# Altium schematic sheet CRSC0005.SchDoc: Critical System Computer - Power
size A3; Engineer: Sam Shan Jiang; DocumentNumber: CRSC0005; SheetNumber: 5; SheetTotal: 5; Description: Voltage regulator and power source select switch; Version: 1.0; DocumentName: Power
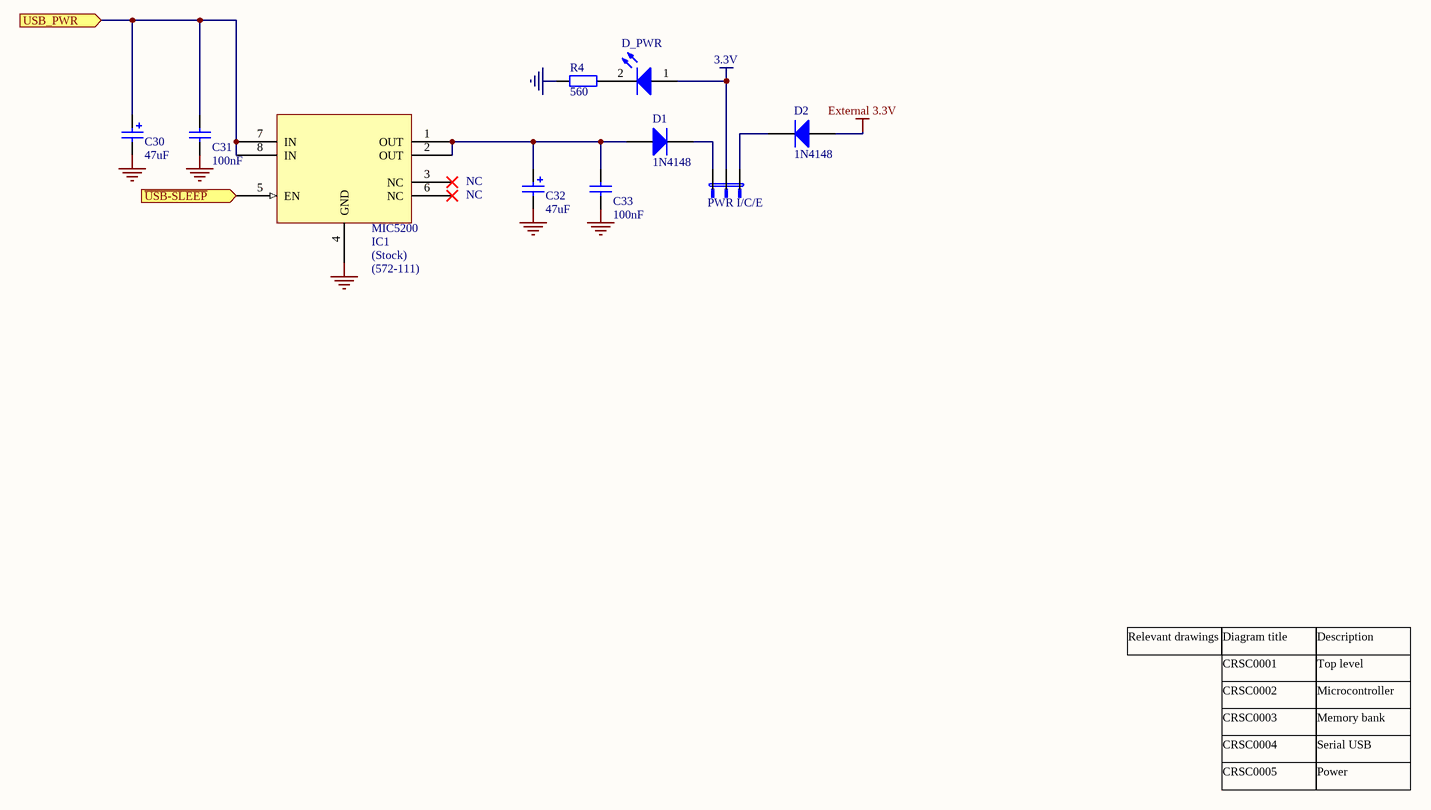
[diagram p0: CRSC0005.SchDoc]

## Parts
C30  value 47uF  [SMDD_E]  (hidden comment: Cap Pol3)
C31  value 100nF  [0805]  (hidden comment: Cap Semi)
C32  value 47uF  [smdd_e]  (hidden comment: Cap Pol3)
C33  value 100nF  [0805]  (hidden comment: Cap Semi)
D1  1N4148  [SOD123]
D2  1N4148  [SOD123]
D_PWR  LED  [0805]  (value not drawn)
IC1  MIC5200  [MIC5200-3.3BM]
PWR_I/C/E  3pins jumper  [JUMPER3pins]  (value not drawn)
R4  560  [0805]

## Ports
USB_PWR (in), ~{USB-SLEEP} (in)

## Nets
3.3V: D_PWR.1(A) PWR_I/C/E.2
External 3.3V: D2.1(A)
GND: C30.2 C31.2 C32.2 C33.2 IC1.4(GND) R4.1
~{USB-SLEEP}: IC1.5(EN) ; port ~{USB-SLEEP}
USB_PWR: C30.1 C31.1 IC1.7(IN) IC1.8(IN) ; port USB_PWR
NetC32_1: C32.1 C33.1 D1.1(A) IC1.1(OUT) IC1.2(OUT)
NetD1_2: D1.2(K) PWR_I/C/E.1
NetD2_2: D2.2(K) PWR_I/C/E.3
NetD_PWR_2: D_PWR.2(K) R4.2

Not connected (* = marked no-connect by the designer): IC1 3(NC)* 6(NC)*

## Notes on the sheet
- NC
- (near IC1) (Stock)
- (near IC1) (572-111)
- Relevant drawings
- CRSC0001
- CRSC0002
- Diagram title
- Top level
- Microcontroller
- Description
- CRSC0003
- CRSC0004
- Memory bank
- Serial USB
- CRSC0005
- Power
- Title
- Description:
- Size:
- Author:
- Date:
- A3
- Time:
- Version
- Sheet:
- Drawing No.:
- of
- File:

## Library data of the parts
C30 C32 = Cap Pol3: Polarized Capacitor (Surface Mount); Manufacturer: Generic Components; Class: Passive; Published: 08/06/2000; Publisher: Altium Hobart Technology Centre; SubClass: Capacitor
C31 C33 = Cap Semi: Capacitor (Semiconductor SIM Model); Manufacturer: Generic Components; Class: Passive; Published: 08/06/2000; Publisher: Altium Hobart Technology Centre; SubClass: Capacitor
D1 D2 = 1N4148: High Conductance Fast Diode; Published: 8-Jun-2000; LatestRevisionDate: 17-Jul-2002; LatestRevisionNote: Re-released for DXP Platform.; DatasheetVersion: 1997; PackageReference: DO-35; Publisher: Altium Limited; Code_JEDEC: DO-204-AH; ComponentLink1Description: Manufacturer Link; ComponentLink1URL: http://www.fairchildsemi.com/; ComponentLink2Description: Datasheet; ComponentLink2URL: http://www.fairchildsemi.com/ds/1N%2F1N4148.pdf
D_PWR = LED0: Typical INFRARED GaAs LED; Manufacturer: Generic Components; Class: Optoelectronic; Published: 08/06/2000; Publisher: Altium Hobart Technology Centre; SubClass: LED
IC1 = MIC5200: MIC5200-3.3BM 3.3V 100mA LDO Voltage Regulator
R4 = Res2: Resistor; Manufacturer: Generic Components; Class: Passive; Published: 08/06/2000; Publisher: Altium Hobart Technology Centre; SubClass: Resistor; Value: 560